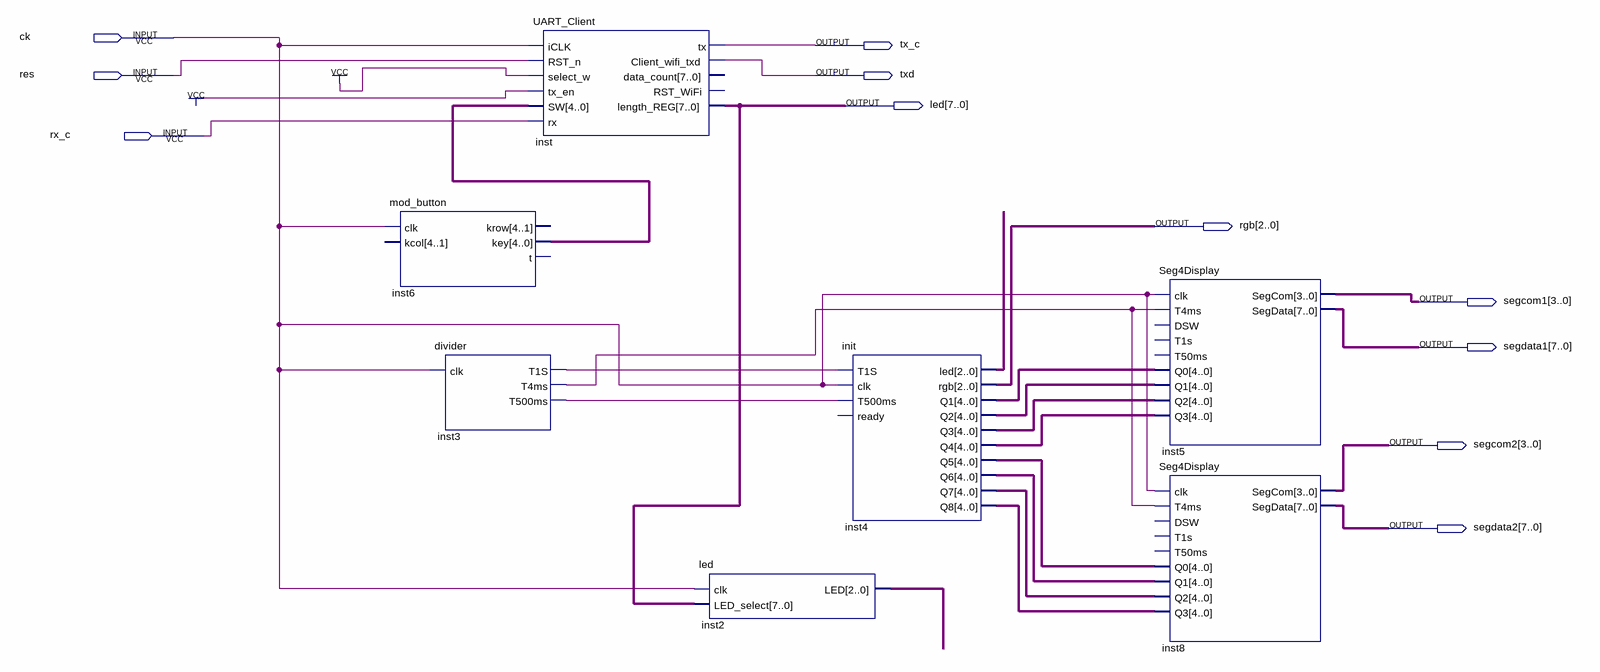
[diagram p0: schematic sheet]
// Quartus schematic top.bdf as structural Verilog: 7 symbols, 11 pins
module top (
  input  ck,
  input  res,
  input  rx_c,
  output tx_c,
  output txd,
  output [7:0] led,
  output [2:0] rgb,
  output [3:0] segcom1,
  output [7:0] segdata1,
  output [3:0] segcom2,
  output [7:0] segdata2
);

  wire inst3_t1s, inst3_t4ms, inst3_t500ms;
  wire [2:0] inst2_led, inst4_led;
  wire [4:0] inst4_q1, inst4_q2, inst4_q3, inst4_q4, inst4_q5, inst4_q6, inst4_q7, inst4_q8, inst6_key;

  mod_button inst6 (.clk(ck), .key(inst6_key));  // open: kcol, krow, t
  divider inst3 (.clk(ck), .T1S(inst3_t1s), .T4ms(inst3_t4ms), .T500ms(inst3_t500ms));
  UART_Client inst (
    .iCLK(ck), .RST_n(res), .select_w(1'b1), .tx_en(1'b1), .SW(inst6_key), .rx(rx_c), .tx(tx_c),
    .Client_wifi_txd(txd), .length_REG(led));  // open: data_count, RST_WiFi
  led inst2 (.clk(ck), .LED_select(led), .LED(inst2_led));
  init inst4 (
    .T1S(inst3_t1s), .clk(ck), .T500ms(inst3_t500ms), .led(inst4_led), .rgb(rgb), .Q1(inst4_q1),
    .Q2(inst4_q2), .Q3(inst4_q3), .Q4(inst4_q4), .Q5(inst4_q5), .Q6(inst4_q6), .Q7(inst4_q7), .Q8(inst4_q8));  // open: ready
  Seg4Display inst5 (
    .clk(ck), .T4ms(inst3_t4ms), .Q0(inst4_q1), .Q1(inst4_q2), .Q2(inst4_q3), .Q3(inst4_q4),
    .SegCom(segcom1), .SegData(segdata1));  // open: DSW, T1s, T50ms
  Seg4Display inst8 (
    .clk(ck), .T4ms(inst3_t4ms), .Q0(inst4_q5), .Q1(inst4_q6), .Q2(inst4_q7), .Q3(inst4_q8),
    .SegCom(segcom2), .SegData(segdata2));  // open: DSW, T1s, T50ms
endmodule
